# Altium schematic sheet Sheet1.SchDoc
size 594 x 420 mm; Organization: ФЕЛ, ДК-81; DocumentNumber: 1; SheetNumber: 1; SheetTotal: 1
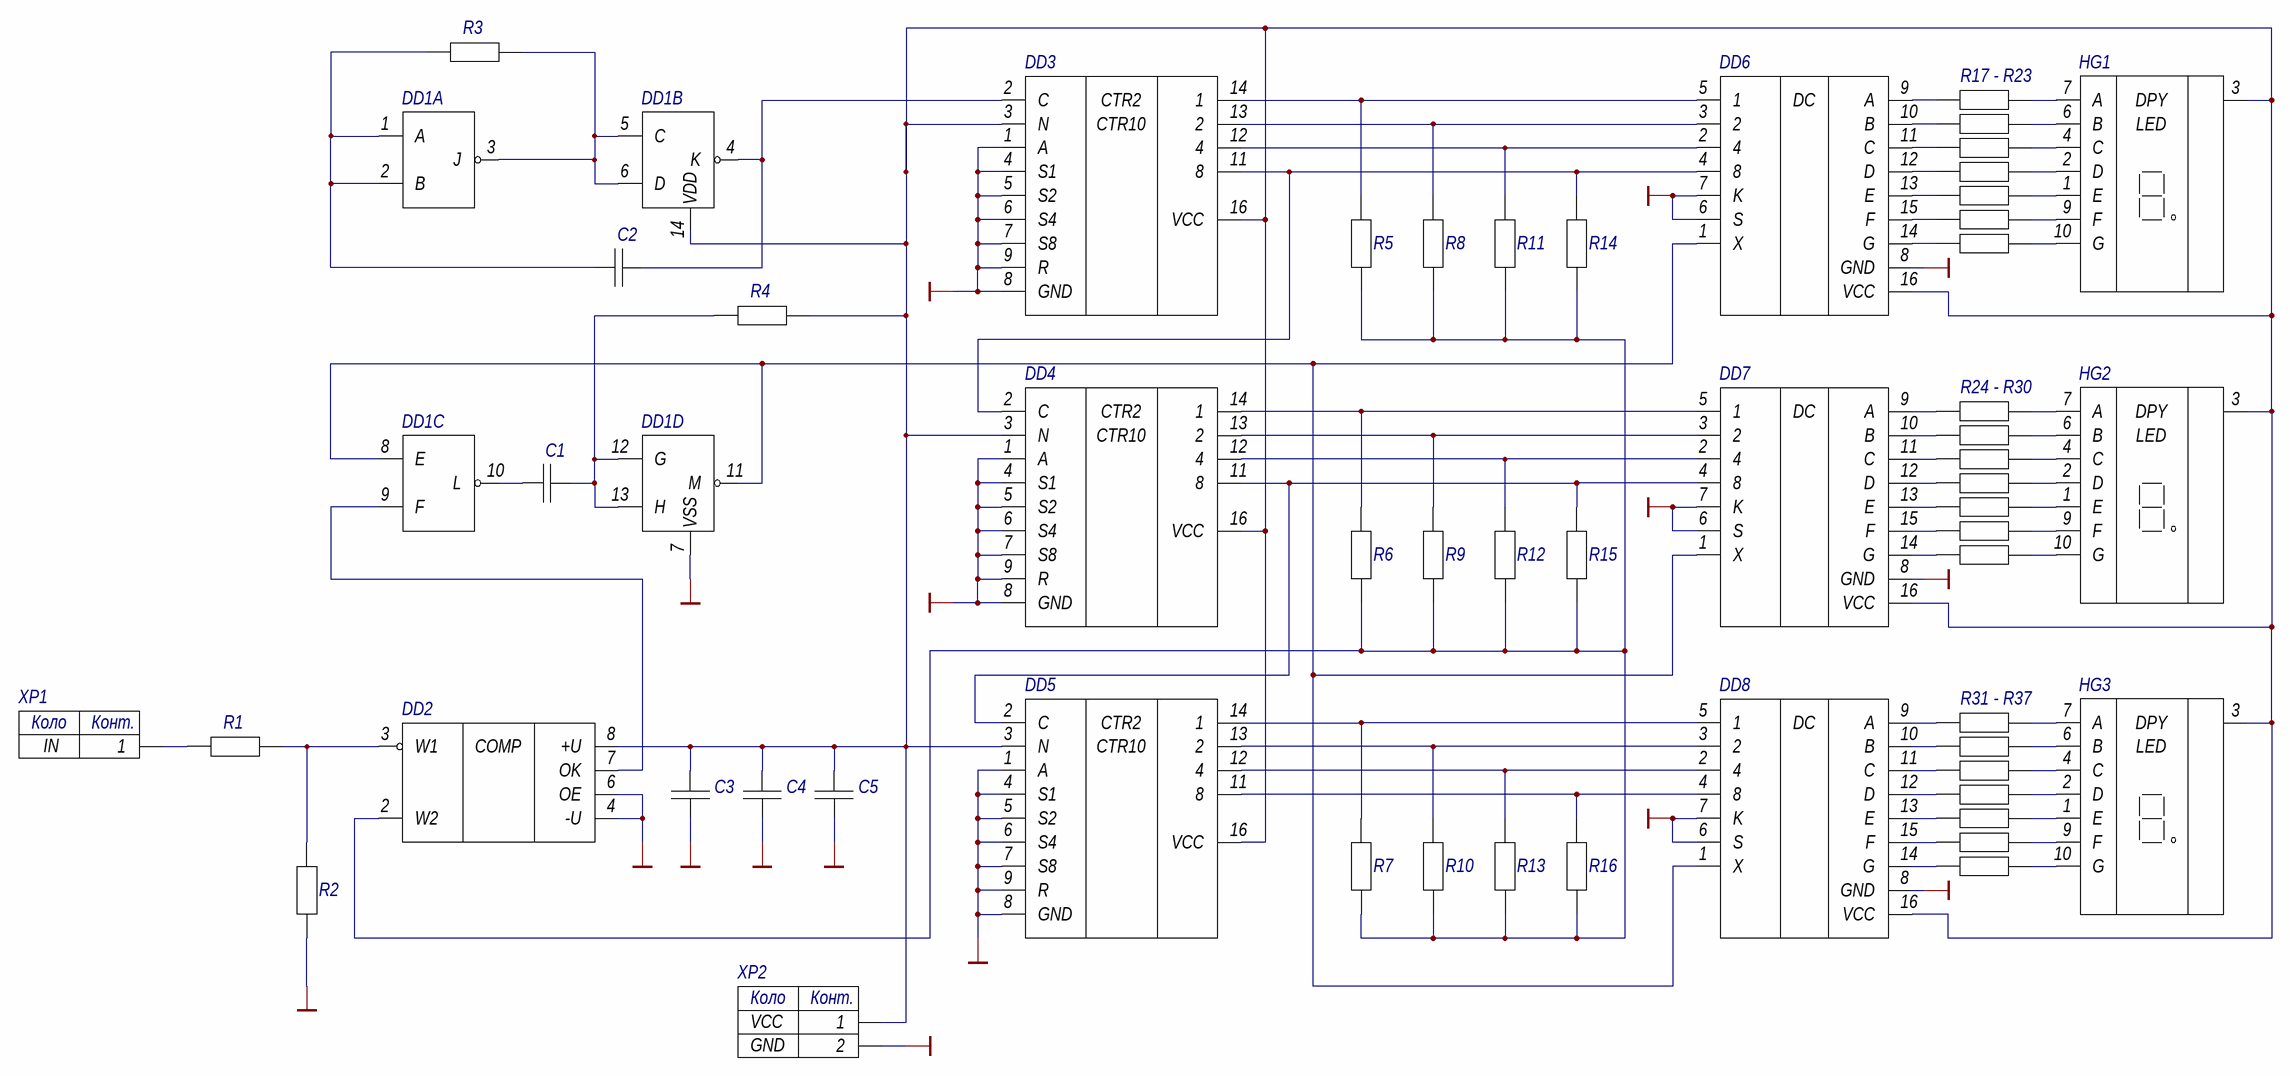
[diagram p0: Sheet1.SchDoc]

## Parts
C1  C-0805 50 В 1,2 нФ 10% X7R KEMET  [CAPC2012X09N]  (value not drawn)
C2  C-0805 50 В 1,8 нФ 10% X7R KEMET  [CAPC2012X09N]  (value not drawn)
C3  C-1210 16 В 100 мкФ 20% X5R KEMET  [CAPC3225X27N]  (value not drawn)
C4  C-1210 16 В 100 мкФ 20% X5R KEMET  [CAPC3225X27N]  (value not drawn)
C5  C-1210 16 В 100 мкФ 20% X5R KEMET  [CAPC3225X27N]  (value not drawn)
DD1  CD4001BPWR Texas Instruments  [TSOP65P640X120-14N]  (value not drawn)  (parts A,B,C,D of 4)
DD2  LM311N STMicroelectronics  [DIP-8_STM]  (value not drawn)
DD3  TC-5971  [TC5971]  (value not drawn)
DD4  TC-5971  [TC5971]  (value not drawn)
DD5  TC-5971  [TC5971]  (value not drawn)
DD6  CD4511BNSR Texas Instruments  [SOIC127P780X200-16N]  (value not drawn)
DD7  CD4511BNSR Texas Instruments  [SOIC127P780X200-16N]  (value not drawn)
DD8  CD4511BNSR Texas Instruments  [SOIC127P780X200-16N]  (value not drawn)
HG1  ACSC56-41QBWA/D-F01 Kingbright  [ACSX56-41]  (value not drawn)
HG2  ACSC56-41QBWA/D-F01 Kingbright  [ACSX56-41]  (value not drawn)
HG3  ACSC56-41QBWA/D-F01 Kingbright  [ACSX56-41]  (value not drawn)
R1  R-0805 0,125 Вт 10 кОм 5% YAGEO  [RESC2012X05N]  (value not drawn)
R2  R-0805 0,125 Вт 100 кОм 5% YAGEO  [RESC2012X05N]  (value not drawn)
R3  R-0805 0,125 Вт 360 кОм 5% YAGEO  [RESC2012X05N]  (value not drawn)
R4  R-0805 0,125 Вт 360 кОм 5% YAGEO  [RESC2012X05N]  (value not drawn)
R5  R-0805 0,125 Вт 36 кОм 5% YAGEO  [RESC2012X05N]  (value not drawn)
R6  R-0805 0,125 Вт 360 кОм 5% YAGEO  [RESC2012X05N]  (value not drawn)
R7  R-0805 0,125 Вт 3,6 МОм 5% YAGEO  [RESC2012X05N]  (value not drawn)
R8  R-0805 0,125 Вт 18 кОм 5% YAGEO  [RESC2012X05N]  (value not drawn)
R9  R-0805 0,125 Вт 180 кОм 5% YAGEO  [RESC2012X05N]  (value not drawn)
R10  R-0805 0,125 Вт 1,8 МОм 5% YAGEO  [RESC2012X05N]  (value not drawn)
R11  R-0805 0,125 Вт 9,1 кОм 5% YAGEO  [RESC2012X05N]  (value not drawn)
R12  R-0805 0,125 Вт 91 кОм 5% YAGEO  [RESC2012X05N]  (value not drawn)
R13  R-0805 0,125 Вт 910 кОм 5% YAGEO  [RESC2012X05N]  (value not drawn)
R14  R-0805 0,125 Вт 4,7 кОм 5% YAGEO  [RESC2012X05N]  (value not drawn)
R15  R-0805 0,125 Вт 47 кОм 5% YAGEO  [RESC2012X05N]  (value not drawn)
R16  R-0805 0,125 Вт 470 кОм 5% YAGEO  [RESC2012X05N]  (value not drawn)
R17  R-0805 0,125 Вт 470 кОм 5% YAGEO  [RESC2012X05N]  (value not drawn)
R18  R-0805 0,125 Вт 470 кОм 5% YAGEO  [RESC2012X05N]  (value not drawn)
R19  R-0805 0,125 Вт 470 кОм 5% YAGEO  [RESC2012X05N]  (value not drawn)
R20  R-0805 0,125 Вт 470 кОм 5% YAGEO  [RESC2012X05N]  (value not drawn)
R21  R-0805 0,125 Вт 470 кОм 5% YAGEO  [RESC2012X05N]  (value not drawn)
R22  R-0805 0,125 Вт 470 кОм 5% YAGEO  [RESC2012X05N]  (value not drawn)
R23  R-0805 0,125 Вт 470 кОм 5% YAGEO  [RESC2012X05N]  (value not drawn)
R24  R-0805 0,125 Вт 470 кОм 5% YAGEO  [RESC2012X05N]  (value not drawn)
R25  R-0805 0,125 Вт 470 кОм 5% YAGEO  [RESC2012X05N]  (value not drawn)
R26  R-0805 0,125 Вт 470 кОм 5% YAGEO  [RESC2012X05N]  (value not drawn)
R27  R-0805 0,125 Вт 470 кОм 5% YAGEO  [RESC2012X05N]  (value not drawn)
R28  R-0805 0,125 Вт 470 кОм 5% YAGEO  [RESC2012X05N]  (value not drawn)
R29  R-0805 0,125 Вт 470 кОм 5% YAGEO  [RESC2012X05N]  (value not drawn)
R30  R-0805 0,125 Вт 470 кОм 5% YAGEO  [RESC2012X05N]  (value not drawn)
R31  R-0805 0,125 Вт 470 кОм 5% YAGEO  [RESC2012X05N]  (value not drawn)
R32  R-0805 0,125 Вт 470 кОм 5% YAGEO  [RESC2012X05N]  (value not drawn)
R33  R-0805 0,125 Вт 470 кОм 5% YAGEO  [RESC2012X05N]  (value not drawn)
R34  R-0805 0,125 Вт 470 кОм 5% YAGEO  [RESC2012X05N]  (value not drawn)
R35  R-0805 0,125 Вт 470 кОм 5% YAGEO  [RESC2012X05N]  (value not drawn)
R36  R-0805 0,125 Вт 470 кОм 5% YAGEO  [RESC2012X05N]  (value not drawn)
R37  R-0805 0,125 Вт 470 кОм 5% YAGEO  [RESC2012X05N]  (value not drawn)
XP1  61300111121 Würth Elektronik  [PLS-1]  (value not drawn)
XP2  61300211121 Würth Elektronik  [PLS-2]  (value not drawn)

## Nets
GND: C3.1 C4.1 C5.1 DD1.7(VSS) DD2.4(-U) DD2.6(OE) DD3.1(A) DD3.4(S1) DD3.5(S2) DD3.6(S4) DD3.7(S8) DD3.8(GND) DD3.9(R) DD4.1(A) DD4.4(S1) DD4.5(S2) DD4.6(S4) DD4.7(S8) DD4.8(GND) DD4.9(R) DD5.1(A) DD5.4(S1) DD5.5(S2) DD5.6(S4) DD5.7(S8) DD5.8(GND) DD5.9(R) DD6.6(S) DD6.7(K) DD6.8(GND) DD7.6(S) DD7.7(K) DD7.8(GND) DD8.6(S) DD8.7(K) DD8.8(GND) R2.1 XP2.2
NetC1_1: C1.1 DD1.10(L)
NetC1_2: C1.2 DD1.12(G) DD1.13(H) R4.1
NetC2_1: C2.1 DD1.1(A) DD1.2(B) R3.1
NetC2_2: C2.2 DD1.4(K) DD3.2(C)
NetC3_2: C3.2 C4.2 C5.2 DD1.14(VDD) DD2.8(+U) DD3.3(N) DD3.16(VCC) DD4.3(N) DD4.16(VCC) DD5.3(N) DD5.16(VCC) DD6.16(VCC) DD7.16(VCC) DD8.16(VCC) HG1.3 HG2.3 HG3.3 R4.2 XP2.1
NetDD1_3: DD1.3(J) DD1.5(C) DD1.6(D) R3.2
NetDD1_8: DD1.8(E) DD1.11(M) DD6.1(X) DD7.1(X) DD8.1(X)
NetDD1_9: DD1.9(F) DD2.7(OK)
NetDD2_2: DD2.2(W2) R5.1 R6.1 R7.1 R8.1 R9.1 R10.1 R11.1 R12.1 R13.1 R14.1 R15.1 R16.1
NetDD2_3: DD2.3(W1) R1.2 R2.2
NetDD3_11: DD3.11(8) DD4.2(C) DD6.4(8) R14.2
NetDD3_12: DD3.12(4) DD6.2(4) R11.2
NetDD3_13: DD3.13(2) DD6.3(2) R8.2
NetDD3_14: DD3.14(1) DD6.5(1) R5.2
NetDD4_11: DD4.11(8) DD5.2(C) DD7.4(8) R15.2
NetDD4_12: DD4.12(4) DD7.2(4) R12.2
NetDD4_13: DD4.13(2) DD7.3(2) R9.2
NetDD4_14: DD4.14(1) DD7.5(1) R6.2
NetDD5_11: DD5.11(8) DD8.4(8) R16.2
NetDD5_12: DD5.12(4) DD8.2(4) R13.2
NetDD5_13: DD5.13(2) DD8.3(2) R10.2
NetDD5_14: DD5.14(1) DD8.5(1) R7.2
NetDD6_9: DD6.9(A) R17.1
NetDD6_10: DD6.10(B) R18.1
NetDD6_11: DD6.11(C) R19.1
NetDD6_12: DD6.12(D) R20.1
NetDD6_13: DD6.13(E) R21.1
NetDD6_14: DD6.14(G) R23.1
NetDD6_15: DD6.15(F) R22.1
NetDD7_9: DD7.9(A) R24.1
NetDD7_10: DD7.10(B) R25.1
NetDD7_11: DD7.11(C) R26.1
NetDD7_12: DD7.12(D) R27.1
NetDD7_13: DD7.13(E) R28.1
NetDD7_14: DD7.14(G) R30.1
NetDD7_15: DD7.15(F) R29.1
NetDD8_9: DD8.9(A) R31.1
NetDD8_10: DD8.10(B) R32.1
NetDD8_11: DD8.11(C) R33.1
NetDD8_12: DD8.12(D) R34.1
NetDD8_13: DD8.13(E) R35.1
NetDD8_14: DD8.14(G) R37.1
NetDD8_15: DD8.15(F) R36.1
NetHG1_1: HG1.1(E) R21.2
NetHG1_2: HG1.2(D) R20.2
NetHG1_4: HG1.4(C) R19.2
NetHG1_6: HG1.6(B) R18.2
NetHG1_7: HG1.7(A) R17.2
NetHG1_9: HG1.9(F) R22.2
NetHG1_10: HG1.10(G) R23.2
NetHG2_1: HG2.1(E) R28.2
NetHG2_2: HG2.2(D) R27.2
NetHG2_4: HG2.4(C) R26.2
NetHG2_6: HG2.6(B) R25.2
NetHG2_7: HG2.7(A) R24.2
NetHG2_9: HG2.9(F) R29.2
NetHG2_10: HG2.10(G) R30.2
NetHG3_1: HG3.1(E) R35.2
NetHG3_2: HG3.2(D) R34.2
NetHG3_4: HG3.4(C) R33.2
NetHG3_6: HG3.6(B) R32.2
NetHG3_7: HG3.7(A) R31.2
NetHG3_9: HG3.9(F) R36.2
NetHG3_10: HG3.10(G) R37.2
NetR1_1: R1.1 XP1.1

## Notes on the sheet
- (near R17) R17 - R23
- (near R24) R24 - R30
- (near R31) R31 - R37
- Перв. застосув.
- Справ. №
- Підп. дата
- Інв. № дубл.
- Взам. інв. №
- Підп. та дата
- Зм.
- Розроб.
- Арк.
- № докум.
- Підп.
- Дата
- Літ.
- Маса
- Маштаб
- Перев.
- Аркушів
- Інв. № подл.
- Н.контр.
- Затв.
- КПІ ім. Ігоря Сікорського
- ALTIUM GOSTBOM2.0 KEV
- Копіював
- Формат А2
- (in symbol 61300111121) Коло; Конт.; IN
- (in symbol 61300211121) Коло; Конт.; VCC; GND
- (in symbol ACSC56-41QBWA/D-F01) DPY; LED
- (in symbol CD4511BNSR) DC
- (in symbol LM311N) COMP
- (in symbol TC-5971) CTR2; CTR10

## Library data of the parts
C1 = C0805C122K5RAC7800: CAP CER 1200PF 50V X7R 0805; Voltage: 50 В; Value: 1,2 нФ; Package: C-0805; Manufacturer: KEMET; Temp_Coef: X7R; Tolerance: 10%
C2 = C0805C182K5RAC7800: CAP CER 1800PF 50V X7R 0805; Voltage: 50 В; Value: 1,8 нФ; Package: C-0805; Manufacturer: KEMET; Temp_Coef: X7R; Tolerance: 10%
C3-C5 = C1210C107M4PAC7800: CAP CER 100UF 16V X5R 1210; Voltage: 16 В; Value: 100 мкФ; Package: C-1210; Manufacturer: KEMET; Temp_Coef: X5R; Tolerance: 20%
DD1 = CD4001BPWR: IC GATE NOR 4CH 2-INP 14TSSOP; Manufacturer: Texas Instruments; Name: CD4001BPWR
DD2 = LM311N: IC VOLTAGE COMPARATOR 8-DIP; Manufacturer: STMicroelectronics; Name: LM311N
DD3-DD5 = TC-5971: IC COUNTER BINARY/DECADE; Name: TC-5971
DD6-DD8 = CD4511BNSR: IC DRVR 7 SEGMENT 16SO; Manufacturer: Texas Instruments; Name: CD4511BNSR
HG1-HG3 = ACSC56-41QBWA/D-F01: DISPLAY 7SEG 0.56" SGL BLU 10SMD; Manufacturer: Kingbright; Name: ACSC56-41QBWA/D-F01
R1 = RC0805JR-0710KL: RES 10K OHM 5% 1/8W 0805; Value: 10 кОм; Power: 0,125 Вт; Tolerance: 5%; Manufacturer: YAGEO; Package: R-0805
R2 = RC0805JR-07100KL: RES 100K OHM 5% 1/8W 0805; Value: 100 кОм; Power: 0,125 Вт; Tolerance: 5%; Manufacturer: YAGEO; Package: R-0805
R3 R4 R6 = RC0805JR-07360KL: RES 360K OHM 5% 1/8W 0805; Value: 360 кОм; Power: 0,125 Вт; Tolerance: 5%; Manufacturer: YAGEO; Package: R-0805
R5 = RC0805JR-0736KL: RES 36K OHM 5% 1/8W 0805; Value: 36 кОм; Power: 0,125 Вт; Tolerance: 5%; Manufacturer: YAGEO; Package: R-0805
R7 = RC0805JR-073M6L: RES 3.6M OHM 5% 1/8W 0805; Value: 3,6 МОм; Power: 0,125 Вт; Tolerance: 5%; Manufacturer: YAGEO; Package: R-0805
R8 = RC0805JR-0718KL: RES 18K OHM 5% 1/8W 0805; Value: 18 кОм; Power: 0,125 Вт; Tolerance: 5%; Manufacturer: YAGEO; Package: R-0805
R9 = RC0805JR-07180KL: RES 180K OHM 5% 1/8W 0805; Value: 180 кОм; Power: 0,125 Вт; Tolerance: 5%; Manufacturer: YAGEO; Package: R-0805
R10 = RC0805JR-071M8L: RES 1.8M OHM 5% 1/8W 0805; Value: 1,8 МОм; Power: 0,125 Вт; Tolerance: 5%; Manufacturer: YAGEO; Package: R-0805
R11 = RC0805JR-079K1L: RES 9.1K OHM 5% 1/8W 0805; Value: 9,1 кОм; Power: 0,125 Вт; Tolerance: 5%; Manufacturer: YAGEO; Package: R-0805
R12 = RC0805JR-0791KL: RES 91K OHM 5% 1/8W 0805; Value: 91 кОм; Power: 0,125 Вт; Tolerance: 5%; Manufacturer: YAGEO; Package: R-0805
R13 = RC0805JR-07910KL: RES 910K OHM 5% 1/8W 0805; Value: 910 кОм; Power: 0,125 Вт; Tolerance: 5%; Manufacturer: YAGEO; Package: R-0805
R14 = RC0805JR-074K7L: RES 4.7K OHM 5% 1/8W 0805; Value: 4,7 кОм; Power: 0,125 Вт; Tolerance: 5%; Manufacturer: YAGEO; Package: R-0805
R15 = RC0805JR-0747KL: RES 47K OHM 5% 1/8W 0805; Value: 47 кОм; Power: 0,125 Вт; Tolerance: 5%; Manufacturer: YAGEO; Package: R-0805
R16-R37 = RC0805JR-07470KL: RES 470K OHM 5% 1/8W 0805; Value: 470 кОм; Power: 0,125 Вт; Tolerance: 5%; Manufacturer: YAGEO; Package: R-0805
XP1 = 61300111121: CONN HEADER VERT 1POS; Manufacturer: Würth Elektronik; Name: 61300111121
XP2 = 61300211121: CONN HEADER VERT 2POS 2.54MM; Manufacturer: Würth Elektronik; Name: 61300211121